# Altium schematic sheet TopLevel.SchDoc
size A4
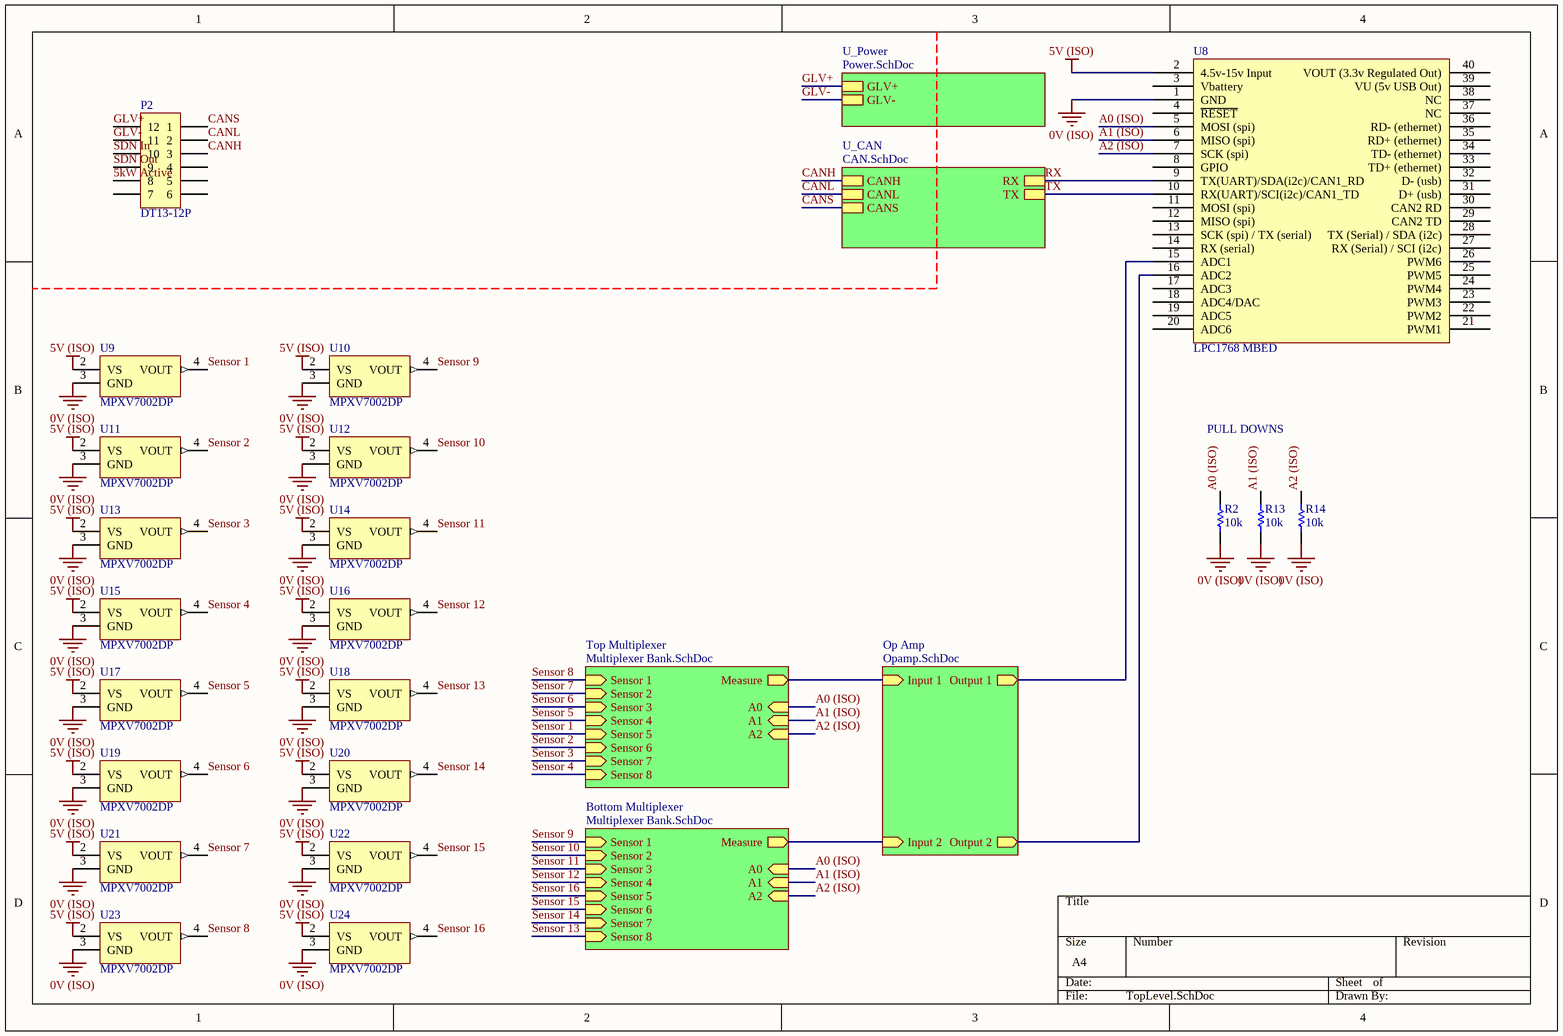
[diagram p0: TopLevel.SchDoc]

## Parts
P2  DT13-12P  [DT13-12P]
R2  10k  [0805]
R13  10k  [0805]
R14  10k  [0805]
U8  LPC1768 MBED  [LPC1768 MBED]
U9  MPXV7002DP  [NXP 8-SOP]
U10  MPXV7002DP  [NXP 8-SOP]
U11  MPXV7002DP  [NXP 8-SOP]
U12  MPXV7002DP  [NXP 8-SOP]
U13  MPXV7002DP  [NXP 8-SOP]
U14  MPXV7002DP  [NXP 8-SOP]
U15  MPXV7002DP  [NXP 8-SOP]
U16  MPXV7002DP  [NXP 8-SOP]
U17  MPXV7002DP  [NXP 8-SOP]
U18  MPXV7002DP  [NXP 8-SOP]
U19  MPXV7002DP  [NXP 8-SOP]
U20  MPXV7002DP  [NXP 8-SOP]
U21  MPXV7002DP  [NXP 8-SOP]
U22  MPXV7002DP  [NXP 8-SOP]
U23  MPXV7002DP  [NXP 8-SOP]
U24  MPXV7002DP  [NXP 8-SOP]

## Sub-sheets
Bottom Multiplexer = Multiplexer Bank.SchDoc: Sensor 1 (in), Sensor 2 (in), Sensor 3 (in), Sensor 4 (in), Sensor 5 (in), Sensor 6 (in), Sensor 7 (in), Sensor 8 (in), A0 (in), A1 (in), A2 (in), Measure (out)
Op Amp = Opamp.SchDoc: Input 1 (in), Output 1 (out), Input 2 (in), Output 2 (out)
Top Multiplexer = Multiplexer Bank.SchDoc: Sensor 1 (in), Sensor 2 (in), Sensor 3 (in), Sensor 4 (in), Sensor 5 (in), Sensor 6 (in), Sensor 7 (in), Sensor 8 (in), A0 (in), A1 (in), A2 (in), Measure (out)
U_CAN = CAN.SchDoc: RX, TX, CANH, CANL, CANS
U_Power = Power.SchDoc: GLV+, GLV-

## Nets
0V (ISO): R2.1 R13.1 R14.1 U8.1(GND) U9.3(GND) U10.3(GND) U11.3(GND) U12.3(GND) U13.3(GND) U14.3(GND) U15.3(GND) U16.3(GND) U17.3(GND) U18.3(GND) U19.3(GND) U20.3(GND) U21.3(GND) U22.3(GND) U23.3(GND) U24.3(GND)
5V (ISO): U8.2(4.5v-15v_Input) U9.2(VS) U10.2(VS) U11.2(VS) U12.2(VS) U13.2(VS) U14.2(VS) U15.2(VS) U16.2(VS) U17.2(VS) U18.2(VS) U19.2(VS) U20.2(VS) U21.2(VS) U22.2(VS) U23.2(VS) U24.2(VS)
5kW Active: P2.8
A0 (ISO): R2.2 U8.5(MOSI_(spi)) ; sheet Top Multiplexer/A0, sheet Bottom Multiplexer/A0
A1 (ISO): R13.2 U8.6(MISO_(spi)) ; sheet Top Multiplexer/A1, sheet Bottom Multiplexer/A1
A2 (ISO): R14.2 U8.7(SCK_(spi)) ; sheet Top Multiplexer/A2, sheet Bottom Multiplexer/A2
CANH: P2.3 ; sheet U_CAN/CANH
CANL: P2.2 ; sheet U_CAN/CANL
CANS: P2.1 ; sheet U_CAN/CANS
GLV+: P2.12 ; sheet U_Power/GLV+
GLV-: P2.11 ; sheet U_Power/GLV-
RX: U8.9(TX(UART)/SDA(i2c)/CAN1_RD) ; sheet U_CAN/RX
SDN In: P2.10
SDN Out: P2.9
Sensor 1: U9.4(VOUT) ; sheet Top Multiplexer/Sensor 5
Sensor 2: U11.4(VOUT) ; sheet Top Multiplexer/Sensor 6
Sensor 3: U13.4(VOUT) ; sheet Top Multiplexer/Sensor 7
Sensor 4: U15.4(VOUT) ; sheet Top Multiplexer/Sensor 8
Sensor 5: U17.4(VOUT) ; sheet Top Multiplexer/Sensor 4
Sensor 6: U19.4(VOUT) ; sheet Top Multiplexer/Sensor 3
Sensor 7: U21.4(VOUT) ; sheet Top Multiplexer/Sensor 2
Sensor 8: U23.4(VOUT) ; sheet Top Multiplexer/Sensor 1
Sensor 9: U10.4(VOUT) ; sheet Bottom Multiplexer/Sensor 1
Sensor 10: U12.4(VOUT) ; sheet Bottom Multiplexer/Sensor 2
Sensor 11: U14.4(VOUT) ; sheet Bottom Multiplexer/Sensor 3
Sensor 12: U16.4(VOUT) ; sheet Bottom Multiplexer/Sensor 4
Sensor 13: U18.4(VOUT) ; sheet Bottom Multiplexer/Sensor 8
Sensor 14: U20.4(VOUT) ; sheet Bottom Multiplexer/Sensor 7
Sensor 15: U22.4(VOUT) ; sheet Bottom Multiplexer/Sensor 6
Sensor 16: U24.4(VOUT) ; sheet Bottom Multiplexer/Sensor 5
TX: U8.10(RX(UART)/SCI(i2c)/CAN1_TD) ; sheet U_CAN/TX
NetU8_15: U8.15(ADC1) ; sheet Op Amp/Output 1
NetU8_16: U8.16(ADC2) ; sheet Op Amp/Output 2
(unnamed): sheet Top Multiplexer/Measure, sheet Op Amp/Input 1
(unnamed): sheet Bottom Multiplexer/Measure, sheet Op Amp/Input 2

Not connected (* = marked no-connect by the designer): P2 4 5 6 7; U8 3(Vbattery) 4(~{RESET}) 8(GPIO) 11(MOSI_(spi)) 12(MISO_(spi)) 13(SCK_(spi)_/_TX_(serial)) 14(RX_(serial)) 17(ADC3) 18(ADC4/DAC) 19(ADC5) 20(ADC6) 21(PWM1) 22(PWM2) 23(PWM3) 24(PWM4) 25(PWM5) 26(PWM6) 27(RX_(Serial)_/_SCI_(i2c)) 28(TX_(Serial)_/_SDA_(i2c)) 29(CAN2_TD) 30(CAN2_RD) 31(D+_(usb)) 32(D-_(usb)) 33(TD+_(ethernet)) 34(TD-_(ethernet)) 35(RD+_(ethernet)) 36(RD-_(ethernet)) 37(NC) 38(NC) 39(VU_(5v_USB_Out)) 40(VOUT_(3.3v_Regulated_Out))

## Notes on the sheet
- PULL DOWNS

## Library data of the parts
P2 = DT13-12P[[/\]]DT13-12P: Positions: 12; Pitch: 4.44mm; Row Spacing: 6.35mm; Angle: 90; Flange: Yes; Contact: Nickel; Part Number: DT13-12P; Digikey Part Number: 1734-1451-ND; Digikey Link: https://www.digikey.com.au/product-detail/en/te-connectivity-deutsch-connectors/DT13-12PA/1734-1451-ND/7220123
R2 R13 R14 = RC0805FR0710KL: Manufacturer: YAGEO; Tolerance: 0.01; Rated Voltage: 0.125W; Part Number: RC0805FR0710KL; Value: 10k; Material: FR-07; qty: 50
U8 = LPC1768 MBED: ARM M3 mBed Enabled Microcontroller; Manufacturer: NXP; Part Number: LPC1768 MBED; Digikey Part Number: 568-4916-ND; Digikey Link: https://www.digikey.com/product-detail/en/nxp-usa-inc/OM11043,598/568-4916-ND/2138502
U9-U24 = MPXV7002DP: Pressure Sensor ±0.29PSI (±2kPa) Differential Male - 0.13" (3.3mm) Tube, Dual 0.5 V ~ 4.5 V 8-BSOP (0.475", 12.06mm Width) Dual Ports, Same Side; Manufacturer: NXP; Part Number: MPXV7002DP; Digikey Part Number: MPXV7002DP-ND; Digikey Link: https://www.digikey.com.au/product-detail/en/nxp-usa-inc/MPXV7002DP/MPXV7002DP-ND/1168436?fbclid=IwAR0MQZl90cLpuihBZbsL3GvMnSHGSbwsdkIDRrDTi8UoGVz_88UawI4CY1w